# EAGLE design PocaFilter (EAGLE 9.6.2)
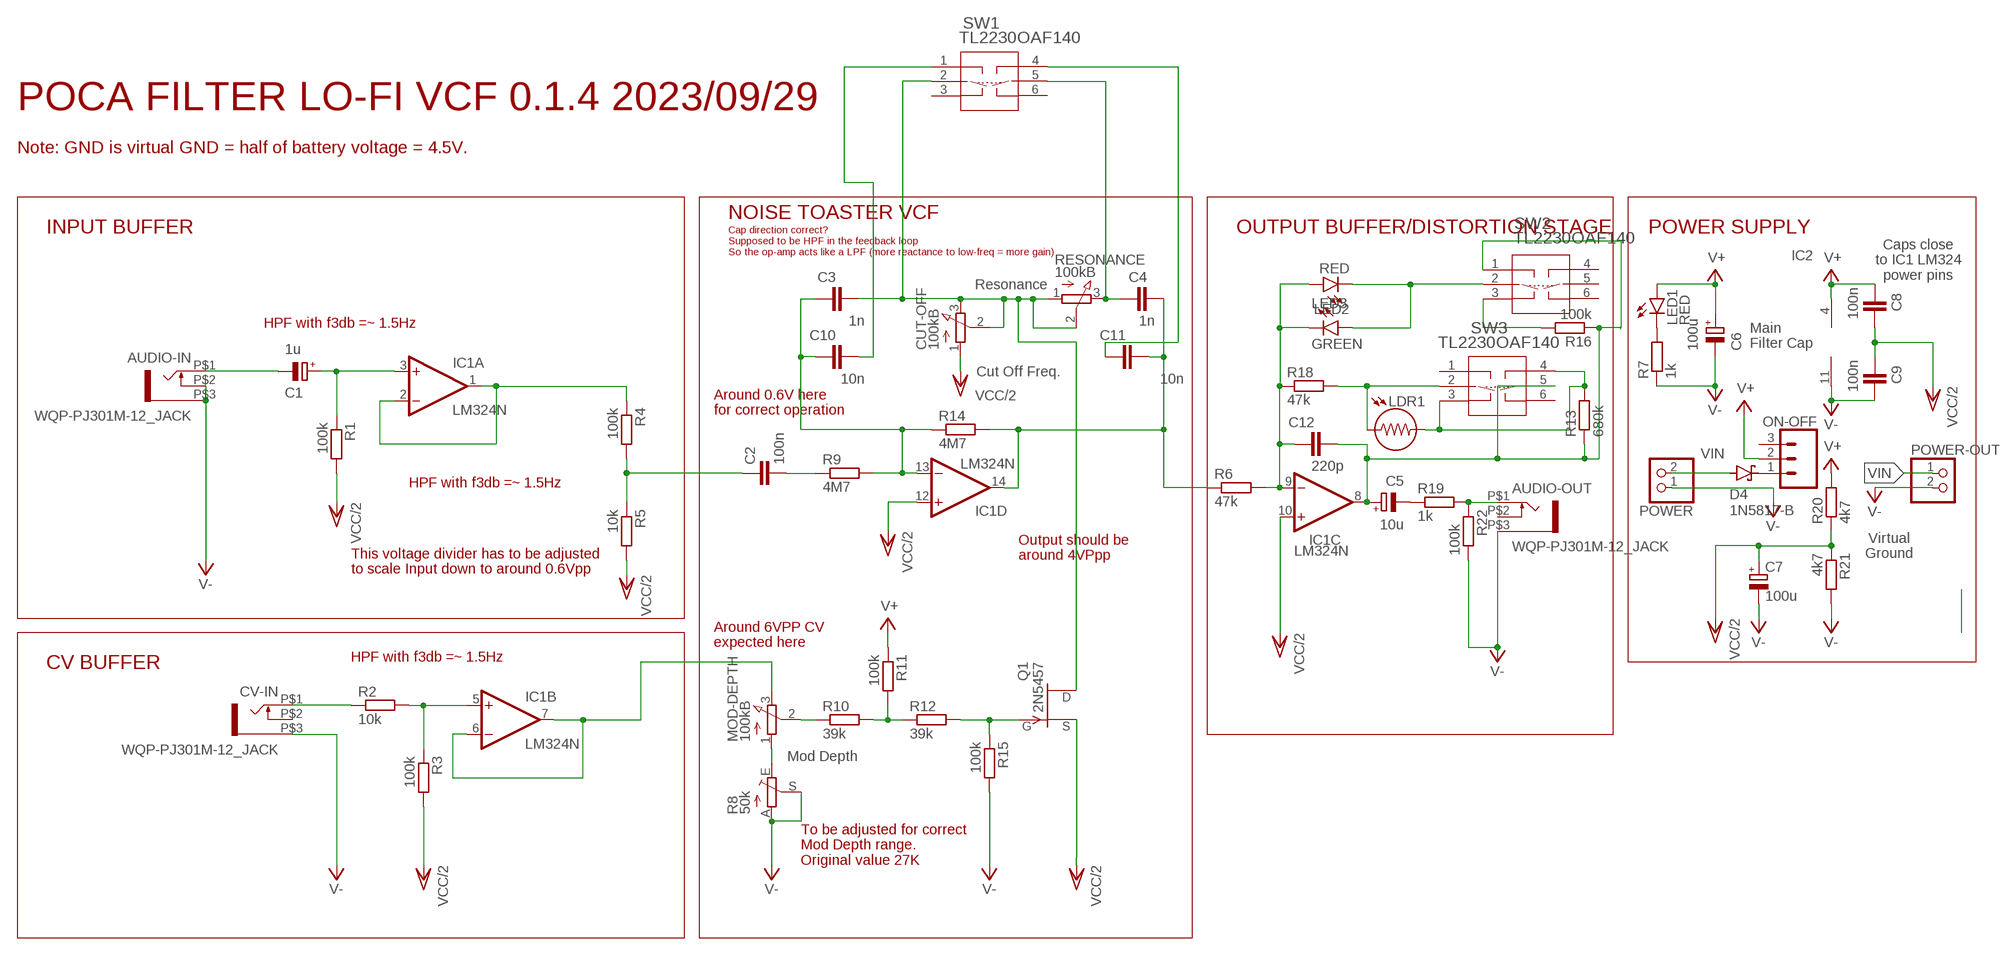
[diagram p0: schematic, sheet 1]

## Parts
AUDIO-IN  WQP-PJ301M-12_JACK  [WQP-PJ301M-12_JACK]
AUDIO-OUT  WQP-PJ301M-12_JACK  [WQP-PJ301M-12_JACK]
C1  1u  CPOL-EUE2.5-6  [E2,5-6]
C2  100n  C-EU050-030X075  [C050-030X075]
C3  1n  C-EU050-030X075  [C050-030X075]
C4  1n  C-EU050-030X075  [C050-030X075]
C5  10u  CPOL-EUE2.5-6  [E2,5-6]
C6  100u  CPOL-EUE2.5-6  [E2,5-6]
C7  100u  CPOL-EUE2,5-6E  [E2,5-6E]
C8  100n  C-EU025-025X050  [C025-025X050]
C9  100n  C-EU025-025X050  [C025-025X050]
C10  10n  C-EU050-030X075  [C050-030X075]
C11  10n  C-EU050-030X075  [C050-030X075]
C12  220p  C-EU025-025X050  [C025-025X050]
CUT-OFF  100kB  EVUF3M  [EVUFXM]
CV-IN  WQP-PJ301M-12_JACK  [WQP-PJ301M-12_JACK]
D4  1N5817-B  [DO41-7.6]
IC1  LM324N  [DIL14]
LDR1  LDR5MM  [LDR338-54C]
LED1  RED  LED3MM  [LED3MM]
LED2  RED  LED3MM  [LED_3MM]
LED3  GREEN  LED3MM  [LED_3MM]
MOD-DEPTH  100kB  EVUF3M  [EVUFXM]
ON-OFF  CONN_03LOCK  [1X03_LOCK]
POWER  PINHD-1X2  [1X02]
POWER-OUT  PINHD-1X2  [1X02]
Q1  2N5457  J201  [TO92]
R1  100k  R-EU_0207/10  [0207/10]
R2  10k  R-EU_0207/10  [0207/10]
R3  100k  R-EU_0207/10  [0207/10]
R4  100k  R-EU_0207/10  [0207/10]
R5  10k  R-EU_0207/10  [0207/10]
R6  47k  R-EU_0207/10  [0207/10]
R7  1k  R-EU_0207/10  [0207/10]
R8  50k  TRIM_EU-CA6V  [CA6V]
R9  4M7  R-EU_0207/10  [0207/10]
R10  39k  R-EU_0207/10  [0207/10]
R11  100k  R-EU_0207/10  [0207/10]
R12  39k  R-EU_0207/10  [0207/10]
R13  680k  R-EU_0207/10  [0207/10]
R14  4M7  R-EU_0207/10  [0207/10]
R15  100k  R-EU_0207/10  [0207/10]
R16  100k  R-EU_0204/7  [0204/7]
R18  47k  R-EU_0207/10  [0207/10]
R19  1k  R-EU_0207/10  [0207/10]
R20  4k7  R-EU_0207/10  [0207/10]
R21  4k7  R-EU_0207/10  [0207/10]
R22  100k  R-EU_0207/10  [0207/10]
RESONANCE  100kB  EVUF3M  [EVUFXM]
SW1  TL2230OAF140  [TL2230_EWI]
SW2  TL2230OAF140  [TL2230_EWI]
SW3  TL2230OAF140  [TL2230_EWI]

## Nets
N$1: CV-IN.P$1 R2.1
N$2: MOD-DEPTH.1(A) R8.E
N$3: IC1.1(A:OUT) IC1.2(A:-IN) R4.1
N$4: C1.+ IC1.3(A:+IN) R1.1
N$5: IC1.6(B:-IN) IC1.7(B:OUT) MOD-DEPTH.3(E)
N$6: AUDIO-IN.P$1 C1.-
N$7: LDR1.2 R13.2 SW3.3 SW3.4
N$8: AUDIO-OUT.P$1 R19.2 R22.1
N$9: C5.- R19.1
N$10: IC1.5(B:+IN) R2.2 R3.1
N$11: C12.1 IC1.9(C:-IN) LED2.A LED3.K(C) R6.2 R18.1
N$12: LDR1.1 R18.2 SW3.2
N$13: LED2.K(C) LED3.A SW2.2
N$14: C11.1 SW1.4
N$16: C10.2 SW1.1
N$17: LED1.K(C) R7.2
N$18: C5.+ C12.2 IC1.8(C:OUT) R13.1 R16.1 SW2.1 SW3.5
N$19: R16.2 SW2.3
N$20: D4.C ON-OFF.1
N$21: C2.2 R9.1
N$23: C3.1 C10.1 IC1.13(D:-IN) R9.2 R14.1
N$25: R10.2 R11.2 R12.1
N$26: Q1.1(G) R12.2 R15.1
V+: C6.+ C8.1 IC1.4(P:V+) LED1.A ON-OFF.2 R11.1 R20.2
V-: AUDIO-IN.P$2 AUDIO-IN.P$3 AUDIO-OUT.P$3 C6.- C7.- C9.2 CV-IN.P$3 IC1.11(P:V-) POWER-OUT.2 POWER.1 R7.1 R8.A R8.S R15.2 R21.2 R22.2
VCC/2: C7.+ C8.2 C9.1 CUT-OFF.1(A) IC1.10(C:+IN) IC1.12(D:+IN) Q1.2(S) R1.2 R3.2 R5.2 R20.1 R21.1
VIN: D4.A POWER-OUT.1 POWER.2
X8: C2.1 R4.2 R5.1
X9: C3.2 CUT-OFF.2(S) CUT-OFF.3(E) Q1.3(D) RESONANCE.1(A) RESONANCE.2(S) SW1.2
X10: C4.1 RESONANCE.3(E) SW1.5
X12: C4.2 C11.2 IC1.14(D:OUT) R6.1 R14.2
X14: MOD-DEPTH.2(S) R10.1
Unconnected: AUDIO-OUT.P$2 CV-IN.P$2 ON-OFF.3 SW1.3 SW1.6 SW2.4 SW2.5 SW2.6 SW3.1 SW3.6

## Notes on the sheet
- POCA FILTER LO-FI VCF 0.1.4 2023/09/29
- Note: GND is virtual GND = half of battery voltage = 4.5V.
- NOISE TOASTER VCF
- INPUT BUFFER | OUTPUT BUFFER/DISTORTION STAGE | POWER SUPPLY
- Cap direction correct?
  Supposed to be HPF in the feedback loop
  So the op-amp acts like a LPF (more reactance to low-freq = more gain)
- IC2
- Caps close
  to IC1 LM324
  power pins
- Resonance
- HPF with f3db =~ 1.5Hz
- Main
  Filter Cap
- Cut Off Freq.
- Around 0.6V here
  for correct operation
- HPF with f3db =~ 1.5Hz
- Virtual
  Ground
- Output should be 
  around 4VPpp
- This voltage divider has to be adjusted
  to scale Input down to around 0.6Vpp
- Around 6VPP CV
  expected here
- CV BUFFER | HPF with f3db =~ 1.5Hz
- Mod Depth
- To be adjusted for correct
  Mod Depth range. 
  Original value 27K

## Library data of the parts
AUDIO-IN AUDIO-OUT CV-IN = thonkiconn:WQP-PJ301M-12_JACK
C1 C5-C7 = rcl:CPOL-EU: POLARIZED CAPACITOR, European symbol; SPICEPREFIX: C
C2-C4 C8-C12 = rcl:C-EU: CAPACITOR, European symbol; SPICEPREFIX: C
CUT-OFF MOD-DEPTH RESONANCE = pot:EVU: 9 mm Square Rotary Potentiometers Source: Panasonic
D4 = diode:1N581*: 1.0A SCHOTTKY BARRIER RECTIFIER Source: http://www.diodes.com/datasheets/ds23001.pdf
IC1 = linear:LM324: OP AMP
LDR1 = gm-resistors:LDR
LED1 = led:LED: LED OSRAM: - CHIPLED LG R971, LG N971, LY N971, LG Q971, LY Q971, LO R971, LY R971 LH N974, LH R974 LS Q976, LO Q976, LY Q976 LO Q996 - Hyper CHIPLED LW Q18S LB Q993, LB Q99A, LB R99A - SideLED LS A670, LO A670, LY A670, LG A670, LP A670 LB A673, LV A673, LT A673, LW A673 LH A674 LY A675 LS A676, LA A676, LO A676, LY A676, LW A676 LS A679, LY A679, LG A679 - Hyper Micro SIDELED® LS Y876, LA Y876, LO Y876, LY Y876 LT Y87S - SmartLED LW L88C, LW L88S LB L89C, LB L89S, LG L890 LS L89K, LO L89K, LY L89K LS L896, LA L896, LO L896, LY L896 - TOPLED LS T670, LO T670, LY T670, LG T670, LP T670 LSG T670, LSP T670, LSY T670, LOP T670, LYG T670 LG T671, LOG T671, LSG T671 LB T673, LV T673, LT T673, LW T673 LH T674 LS T676, LA T676, LO T676, LY T676, LB T676, LH T676, LSB T676, LW T676 LB T67C, LV T67C, LT T67C, LS T67K, LO T67K, LY T67K, LW E67C LS E67B, LA E67B, LO E67B, LY E67B, LB E67C, LV E67C, LT E67C LW T67C LS T679, LY T679, LG T679 LS T770, LO T770, LY T770, LG T770, LP T770 LB T773, LV T773, LT T773, LW T773 LH T774 LS E675, LA E675, LY E675, LS T675 LS T776, LA T776, LO T776, LY T776, LB T776 LHGB T686 LT T68C, LB T68C - Hyper Mini TOPLED® LB M676 - Mini TOPLED Santana® LG M470 LS M47K, LO M47K, LY M47K Source: http://www.osram.convergy.de LUXEON: - LUMILED® LXK2-PW12-R00, LXK2-PW12-S00, LXK2-PW14-U00, LXK2-PW14-V00 LXK2-PM12-R00, LXK2-PM12-S00, LXK2-PM14-U00 LXK2-PE12-Q00, LXK2-PE12-R00, LXK2-PE12-S00, LXK2-PE14-T00, LXK2-PE14-U00 LXK2-PB12-K00, LXK2-PB12-L00, LXK2-PB12-M00, LXK2-PB14-N00, LXK2-PB14-P00, LXK2-PB14-Q00 LXK2-PR12-L00, LXK2-PR12-M00, LXK2-PR14-Q00, LXK2-PR14-R00 LXK2-PD12-Q00, LXK2-PD12-R00, LXK2-PD12-S00 LXK2-PH12-R00, LXK2-PH12-S00 LXK2-PL12-P00, LXK2-PL12-Q00, LXK2-PL12-R00 Source: www.luxeon.com KINGBRIGHT: KA-3528ASYC Source: www.kingbright.com
LED2 LED3 = SparkFun-LED:LED: LED (Generic) Standard schematic elements and footprints for 5mm, 3mm, 1206, and 0603 sized LEDs. Generic LEDs with no color specified.; PROD_ID: DIO-08794
ON-OFF = SparkFun-Connectors:CONN_03: Multi connection point. Often used as Generic Header-pin footprint for 0.1 inch spaced/style header connections On any of the 0.1 inch spaced packages, you can populate with these: Break Away Headers - Straight <https://www.sparkfun.com/products/116> (PRT-00116) Break Away Male Headers - Right Angle <https://www.sparkfun.com/products/553> (PRT-00553) Female Headers <https://www.sparkfun.com/products/115> (PRT-00115) Break Away Headers - Machine Pin <https://www.sparkfun.com/products/117> (PRT-00117) Break Away Female Headers - Swiss Machine Pin <https://www.sparkfun.com/products/743> (PRT-00743) Stackable Header - 3 Pin (Female, 0.1") <https://www.sparkfun.com/products/13875> (PRT-13875) For SCREWTERMINALS and SPRING TERMINALS visit here: Screw Terimnals on SparkFun.com <https://www.sparkfun.com/search/results?term=Screw+Terminals> (5mm/3.5mm/2.54mm spacing) This device is also useful as a general connection point to wire up your design to another part of your project. Our various solder wires solder well into these plated through hole pads. Hook-Up Wire - Assortment (Stranded, 22 AWG) <https://www.sparkfun.com/products/11375> (PRT-11375) Hook-Up Wire - Assortment (Solid Core, 22 AWG) <https://www.sparkfun.com/products/11367> (PRT-11367) View the entire wire category on our website here <https://www.sparkfun.com/categories/141> Special notes: Molex polarized connector foot print use with SKU : PRT-08232 with associated crimp pins and housings.
POWER POWER-OUT = pinhead:PINHD-1X2: PIN HEADER
Q1 = transistor-fet:?20*: TEMIC / Siliconix N-Channel JFET Source: JFET-J201_Siliconix_data.pdf
R1-R7 R9-R16 R18-R22 = rcl:R-EU_: RESISTOR, European symbol; SPICEPREFIX: R
R8 = pot:TRIM_EU-: POTENTIOMETER
SW1-SW3 = ESW-UltraLib:TL2230OAF140; COPYRIGHT: Copyright (C) 2023 Ultra Librarian. All rights reserved.; MANUFACTURER_PART_NUMBER: TL2230OAF140; MFR_NAME: E-Switch

## Board
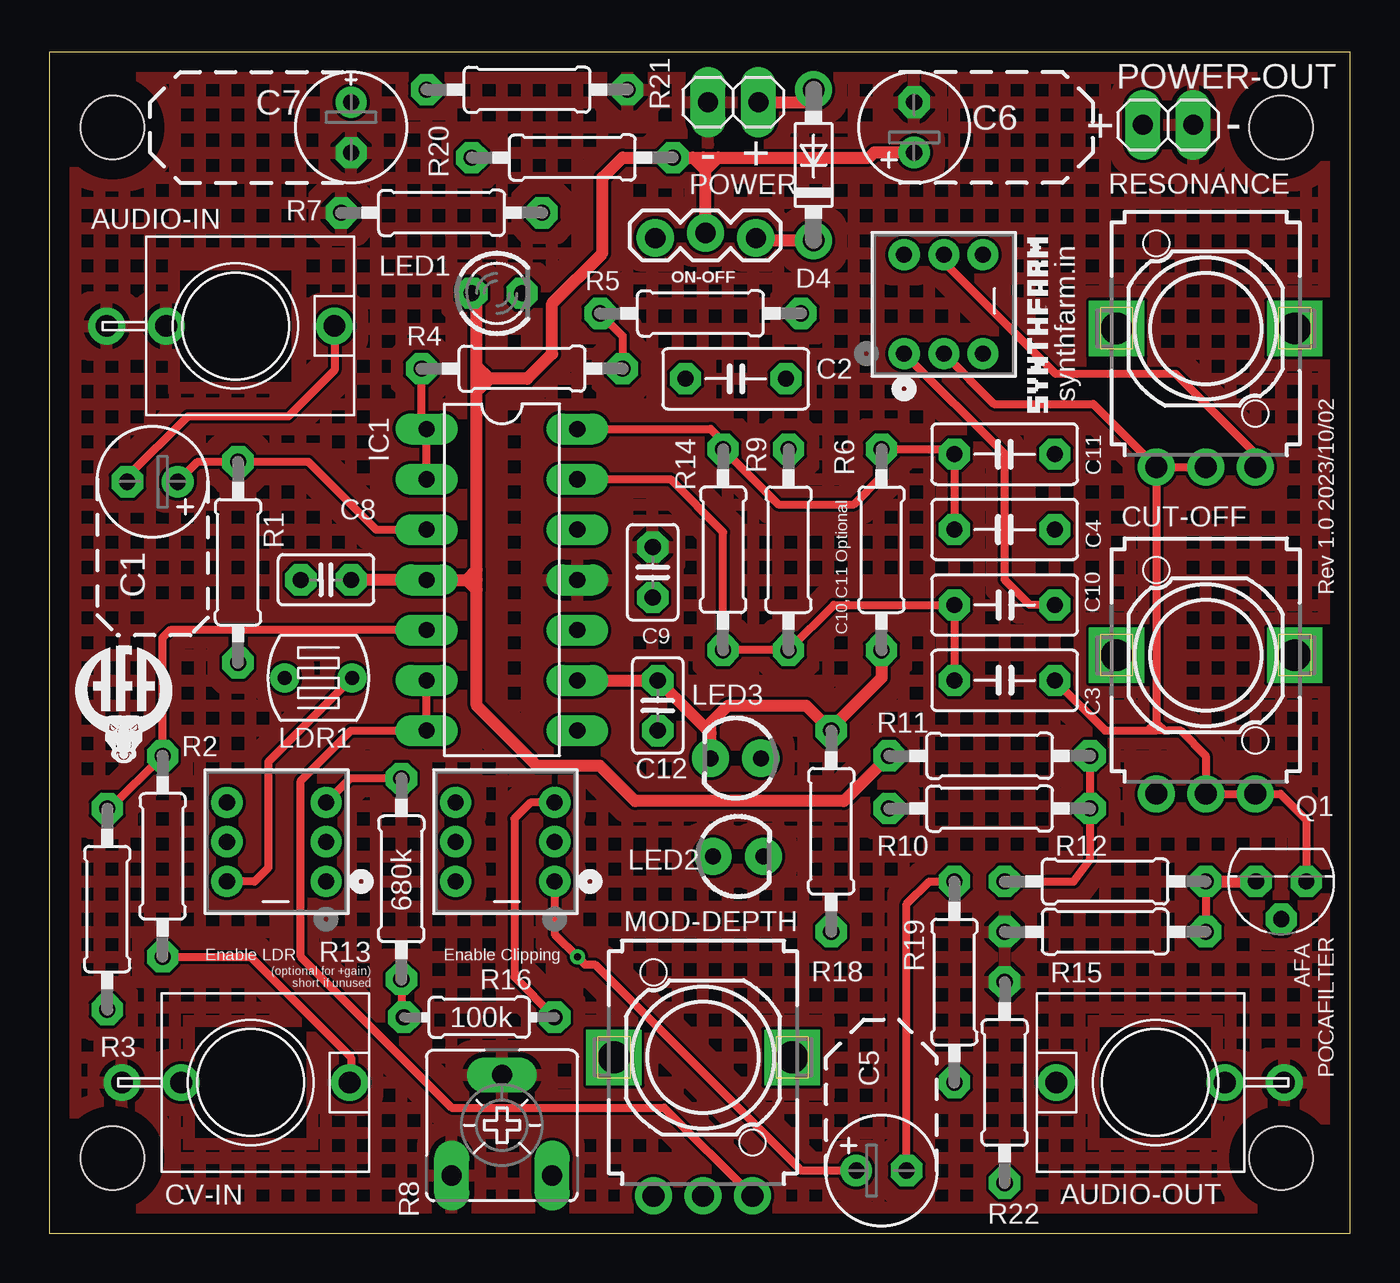
[diagram p1: board, top side]
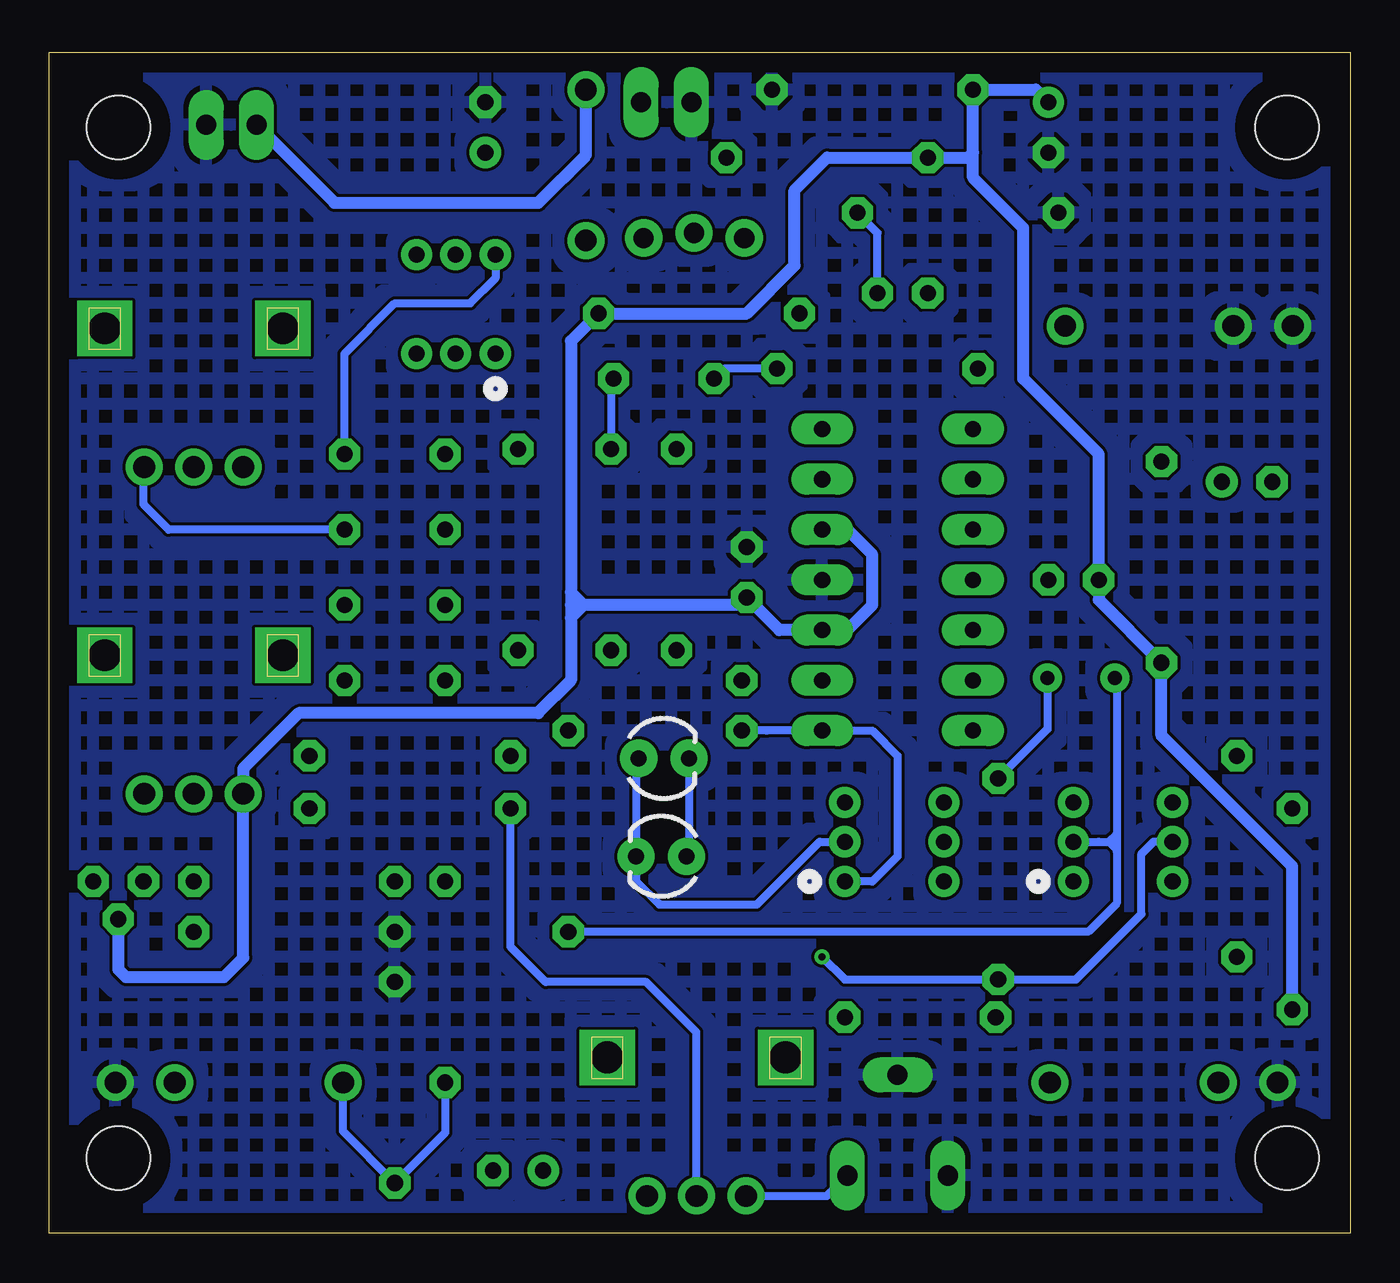
[diagram p2: board, bottom side, seen from below]

Size 65.71 x 59.68 mm. Coordinates in mm from the lower left corner, seen from the top.
Outline: 0,0 65.71,0 65.71,59.68 0,59.68 0,0
Copper layers (1*16): Top 0.035mm / dielectric 1.5mm / Bottom 0.035mm
Design rules "default *": minimum track width 6mil, minimum drill 0.35mm, track to track 6mil, track to pad 6mil, pad to pad 6mil, via to via 6mil, smd to smd 6mil, copper to edge 40mil, drill to drill 6mil, minimum pad ring 15mil, minimum via ring 8mil, stop-mask expansion 4mil, vias tented up to drill 0mil, thermal gap 10mil
Holes 3.2 mm at 3.17,55.88 3.17,3.81 62.23,55.88 62.23,3.81

### Footprints (pad centres in the part's own frame; a part is rotated, then mirrored left to right if it is on the bottom)
WQP-PJ301M-12_JACK = drill 1.1: P$1 0,5; P$2 0,-3.5; P$3 0,-6.5
E2,5-6 = drill 0.813 pad 1.6: + -1.27,0 | drill 0.813 pad 1.6 octagon: - 1.27,0
C050-030X075 = drill 0.813 octagon: 1 -2.54,0; 2 2.54,0
E2,5-6E = drill 0.813 pad 1.575: + -1.27,0 | drill 0.813 pad 1.575 octagon: - 1.27,0
C025-025X050 = drill 0.813 octagon: 1 -1.27,0; 2 1.27,0
EVUFXM = drill 1.1 pad 1.676: 1 -2.5,-7; 2 0,-7; 3 2.5,-7 | drill 1.6 pad 2.8 square: M1 4.5,0; M2 -4.5,0
DO41-7.6 = drill 1.1 pad 1.7: A 3.81,0; C -3.81,0
DIL14 = drill 0.813 long: 1 -7.62,-3.81; 2 -5.08,-3.81; 3 -2.54,-3.81; 4 0,-3.81; 5 2.54,-3.81; 6 5.08,-3.81; 7 7.62,-3.81; 8 7.62,3.81; 9 5.08,3.81; 10 2.54,3.81; 11 0,3.81; 12 -2.54,3.81; 13 -5.08,3.81; 14 -7.62,3.81
LDR338-54C = drill 0.7: 1 0,1.702; 2 0,-1.702
LED3MM = drill 0.813 octagon: A -1.27,0; K 1.27,0
LED_3MM = drill 0.813 pad 1.88: A -1.27,0; K 1.27,0
1X03_LOCK = drill 1.016 pad 1.88: 1 0,0.127; 2 2.54,-0.127; 3 5.08,0.127
1X02 = drill 1.016 long: 1 -1.27,0; 2 1.27,0
TO92 = drill 0.813 octagon: 1 1.27,0; 2 0,1.905; 3 -1.27,0
0207/10 = drill 0.813 octagon: 1 -5.08,0; 2 5.08,0
CA6V = drill 1.016 long: A -2.54,-2.54; E 2.54,-2.54; S 0,2.54
0204/7 = drill 0.813 octagon: 1 -3.81,0; 2 3.81,0
TL2230_EWI = drill 0.813 pad 1.321: 1 0,0; 2 0,-2.007; 3 0,-3.988; 4 5.004,0; 5 5.004,-2.007; 6 5.004,-3.988

### Placement (x,y rotation side)
AUDIO-IN  9.4,45.85 270 top
AUDIO-OUT  55.88,7.62 90 top
C1  5.21,37.97 180 top
C2  34.67,43.18 0 top
C3  48.26,27.94 0 top
C4  48.26,35.56 180 top
C5  42.04,3.17 0 top
C6  43.69,55.88 90 top
C7  15.24,55.88 270 top
C8  13.97,33.02 180 top
C9  30.48,33.4 90 top
C10  48.26,31.75 0 top
C11  48.26,39.37 180 top
C12  30.73,26.67 270 top
CUT-OFF  58.42,29.21 0 top
CV-IN  10.16,7.62 270 top
D4  38.61,53.98 90 top
IC1  22.86,33.02 270 top
LDR1  13.59,28.07 90 top
LED1  22.61,47.5 0 top
LED2  34.8,19.05 0 top
LED3  34.67,24 180 top
MOD-DEPTH  33.02,8.89 0 top
ON-OFF  35.69,50.42 180 top
POWER  34.54,57.15 0 top
POWER-OUT  56.52,56.01 0 top
Q1  62.23,17.78 180 top
R1  9.53,33.91 270 top
R2  5.71,19.05 90 top
R3  2.92,16.38 270 top
R4  23.88,43.69 0 top
R5  32.89,46.48 0 top
R6  42.04,34.54 270 top
R7  19.81,51.56 0 top
R8  22.86,5.46 0 top
R9  37.34,34.54 270 top
R10  47.5,21.46 0 top
R11  47.5,24.13 0 top
R12  53.34,17.78 0 top
R13  17.78,17.91 90 top
R14  34.04,34.54 90 top
R15  53.34,15.24 180 top
R16  21.72,10.92 0 top
R18  39.5,20.32 270 top
R19  45.72,12.7 270 top
R20  26.42,54.36 0 top
R21  24.13,57.78 0 top
R22  48.26,7.62 90 top
RESONANCE  58.42,45.72 0 top
SW1  43.18,44.45 90 top
SW2  25.53,17.78 180 top
SW3  13.97,17.78 180 top

### Tracks (layer width: path | path; a pad name or v marks a point on that pad's centre or on a via)
N$1
  Top 0.406: R2.1 10.16,13.97 15.24,8.89 15.24,7.7 CV-IN.P$1
N$2
  Bottom 0.406: MOD-DEPTH.1 26.43,1.89 R8.E
N$3
  Top 0.406: IC1.2 IC1.1 18.8,40.89 R4.1
N$4
  Top 0.406: R1.1 10.16,38.99 | 10.16,38.99 13.08,38.99 16.51,35.56 IC1.3 | C1.+ 7.49,38.99 10.16,38.99
N$5
  Top 0.406: MOD-DEPTH.3 31.06,6.35 20.32,6.35 12.7,13.97 12.7,22.86 15.24,25.4 IC1.7 IC1.6
N$6
  Top 0.406: AUDIO-IN.P$1 14.4,43.61 12.06,41.27 6.99,41.27 3.94,38.23 C1.-
N$7
  Top 0.406: LDR1.2 11.05,23.82 11.05,18.47 10.36,17.78 SW3.4 | R13.2 15.19,22.99 SW3.3
  Bottom 0.406: LDR1.2 15.29,25.48 R13.2
N$8
  Bottom 0.406: R19.2 45.72,5.08 R22.1 50.88,5.16 AUDIO-OUT.P$1
N$9
  Top 0.406: R19.1 44.45,17.78 43.31,16.64 C5.-
N$10
  Top 0.406: IC1.5 6.1,30.48 5.71,30.1 R2.2 3.05,21.46 R3.1
N$11
  Top 0.61: IC1.9 C12.1 33.4,25.27 | LED3.K 33.4,25.27 | 33.4,25.27 33.4,25.78 34.29,26.67 38.23,26.67 39.43,25.46 | 39.43,25.46 R18.1 | R6.2 42.04,28.07 39.43,25.46
  Bottom 0.406: LED3.K 33.4,19.18 LED2.A
N$12
  Bottom 0.406: R18.2 13.22,15.24 11.79,16.68 11.79,19.3 11.79,19.41 | LDR1.1 11.79,27.96 11.79,20.19 | 11.79,20.19 11.79,19.81 | 11.79,19.81 11.79,19.41 | SW3.2 12.7,19.79 12.19,19.79 | 12.19,19.79 11.81,19.79 11.79,19.81 | 12.19,19.79 12.18,19.8 | 12.18,19.8 11.79,20.19 | 12.18,19.8 11.79,19.41
N$13
  Bottom 0.406: LED3.A 36.07,23.88 LED2.K 36.07,17.78 34.9,16.61 29.97,16.61 26.8,19.79 SW2.2
N$14
  Bottom 0.406: SW1.4 43.18,48.26 44.45,46.99 48.26,46.99 50.8,44.45 C11.1
N$16
  Top 0.406: SW1.1 48.26,39.37 48.26,33.02 49.53,31.75 C10.2
N$17
  Bottom 0.406: LED1.K 23.88,50.55 R7.2
N$18  (via drill 0.35)
  Top 0.406: R13.1 17.78,10.98 R16.1 | SW2.1 25.53,15.11 v26.67,13.97 27.05,13.59 27.56,13.59 37.97,3.17 C5.+
  Bottom 0.406: SW3.5 9.93,19.79 10.54,19.18 10.54,16.13 13.84,12.83 R13.1 25.53,12.83 v26.67,13.97 | SW2.1 24.13,17.78 22.86,19.05 22.86,24.13 24.13,25.4 IC1.8 29.46,25.4 C12.2
N$19
  Top 0.406: R16.2 23.5,12.95 23.5,20.95 24.31,21.77 SW2.3
N$20
  Top 0.61: D4.C 35.81,50.16 ON-OFF.1
N$21
  Bottom 0.406: C2.2 37.34,43.05 R9.1
N$23
  Top 0.406: IC1.13 31.37,38.1 34.04,35.43 R14.1 R9.2 39.62,31.75 C10.1 C3.1
N$25
  Top 0.406: R12.1 51.75,17.78 52.58,18.88 R10.2 R11.2
N$26
  Top 0.406: R12.2 R15.1
  Top 0.61: R12.2 Q1.1
V+
  Top 0.61: C8.1 IC1.4 21.08,33.02 | 21.59,32.51 21.59,26.67 24.64,23.62 27.81,23.62 29.59,21.84 40.13,21.84 R11.1 | 21.59,32.51 21.59,33.02 | 21.59,33.02 21.08,33.02 | 21.59,33.02 21.59,33.53 | 21.59,33.53 21.08,33.02 | 21.08,33.02 21.59,32.51 | 21.59,33.53 21.59,42.55 | 21.59,42.55 21.59,43.18 | 21.59,43.18 21.59,43.81 | 21.59,43.81 21.59,47.24 LED1.A | 32.51,54.36 31.75,54.36 R20.2 28.96,54.36 27.94,53.34 27.94,49.53 25.4,46.99 25.4,44.45 24.13,43.18 22.23,43.18 | 32.51,54.36 33.02,54.36 | 33.02,54.36 33.78,54.36 | 33.78,54.36 41.4,54.36 41.66,54.61 C6.+ | 33.02,54.36 33.15,54.23 33.15,53.72 | 22.23,43.18 21.59,43.18 | 21.59,43.81 22.23,43.18 | 21.59,42.55 22.23,43.18 | 33.15,53.72 32.51,54.36 | ON-OFF.2 33.15,53.72 | 33.15,53.72 33.78,54.36
V-
  pour Top (hatched): -1.27,31.75 -1.27,60.96 67.31,60.96 67.31,-1.27 -1.27,-1.27
  pour Bottom (hatched): -2.54,-2.54 -2.54,62.23 68.58,62.23 68.58,-2.54
VCC/2
  Bottom 0.61: C7.+ 15.88,57.78 R21.1 19.05,54.61 | Q1.2 62.23,13.34 61.85,12.95 56.9,12.95 55.92,13.93 CUT-OFF.1 55.92,23.48 53.11,26.29 41.02,26.29 39.37,27.94 39.37,31.11 | IC1.12 25.4,35.56 24.13,34.29 24.13,31.75 25.4,30.48 IC1.10 28.83,30.48 C9.1 30.86,31.75 38.73,31.75 | 39.37,32.38 39.37,45.09 R5.2 30.48,46.48 28.07,48.9 28.07,52.7 26.42,54.36 R20.1 19.3,54.36 19.05,54.61 | 39.37,32.38 39.37,31.75 | 39.37,31.75 39.37,31.11 | 19.05,54.61 19.05,53.34 16.51,50.8 16.51,43.18 12.7,39.37 C8.2 12.7,32 R1.2 9.53,25.15 2.92,18.54 R3.2 | 38.73,31.75 39.37,31.75 | 39.37,32.38 38.73,31.75 | 38.73,31.75 39.37,31.11
VIN
  Top 0.61: POWER.2 38.35,57.15 38.61,57.4 D4.A
  Bottom 0.61: POWER-OUT.1 51.31,52.07 41.02,52.07 38.61,54.48 D4.A
X8
  Top 0.406: R5.1 28.96,45.34 R4.2
  Bottom 0.406: R4.2 31.62,43.69 C2.1
X9
  Top 0.406: Q1.3 63.5,20.9 62.19,22.21 CUT-OFF.3 CUT-OFF.2 58.42,24.13 57.15,25.4 56.52,25.4 56.34,25.4 | SW1.2 47.73,41.91 52.73,41.91 RESONANCE.1 | RESONANCE.1 RESONANCE.2 | 55.5,25.4 53.34,25.4 C3.2 | 55.5,25.4 55.88,25.4 | 56.34,25.4 55.88,25.4 | RESONANCE.1 55.92,25.82 | 55.92,25.82 55.92,25.44 55.88,25.4 | 55.92,25.82 55.5,25.4 | 55.92,25.82 56.34,25.4
X10
  Top 0.406: SW1.5 45.19,49.07 50.83,43.43 56.9,43.43 60.96,39.37 60.92,39.33 RESONANCE.3
  Bottom 0.406: RESONANCE.3 60.96,38.68 60.96,36.83 59.69,35.56 C4.1
X12
  Top 0.406: IC1.14 33.4,40.64 34.04,40.01 R14.2 36.83,36.83 40.64,36.83 42.04,38.23 R6.1 45.47,39.62 C11.2 C4.2
X14
  Bottom 0.406: MOD-DEPTH.2 33.02,10.16 35.56,12.7 40.64,12.7 42.42,14.48 R10.1

### Text on the board
tPlace: synthfarm.in | AFA / POCAFILTER
tNames: + | - | - | + | C10,C11 Optional | Rev 1.0 2023/10/02 | Enable LDR | Enable Clipping | (optional for +gain) / short if unused
tValues: 100uF | FREQ RANGE | LDR EN | CLP EN
Name: - | +